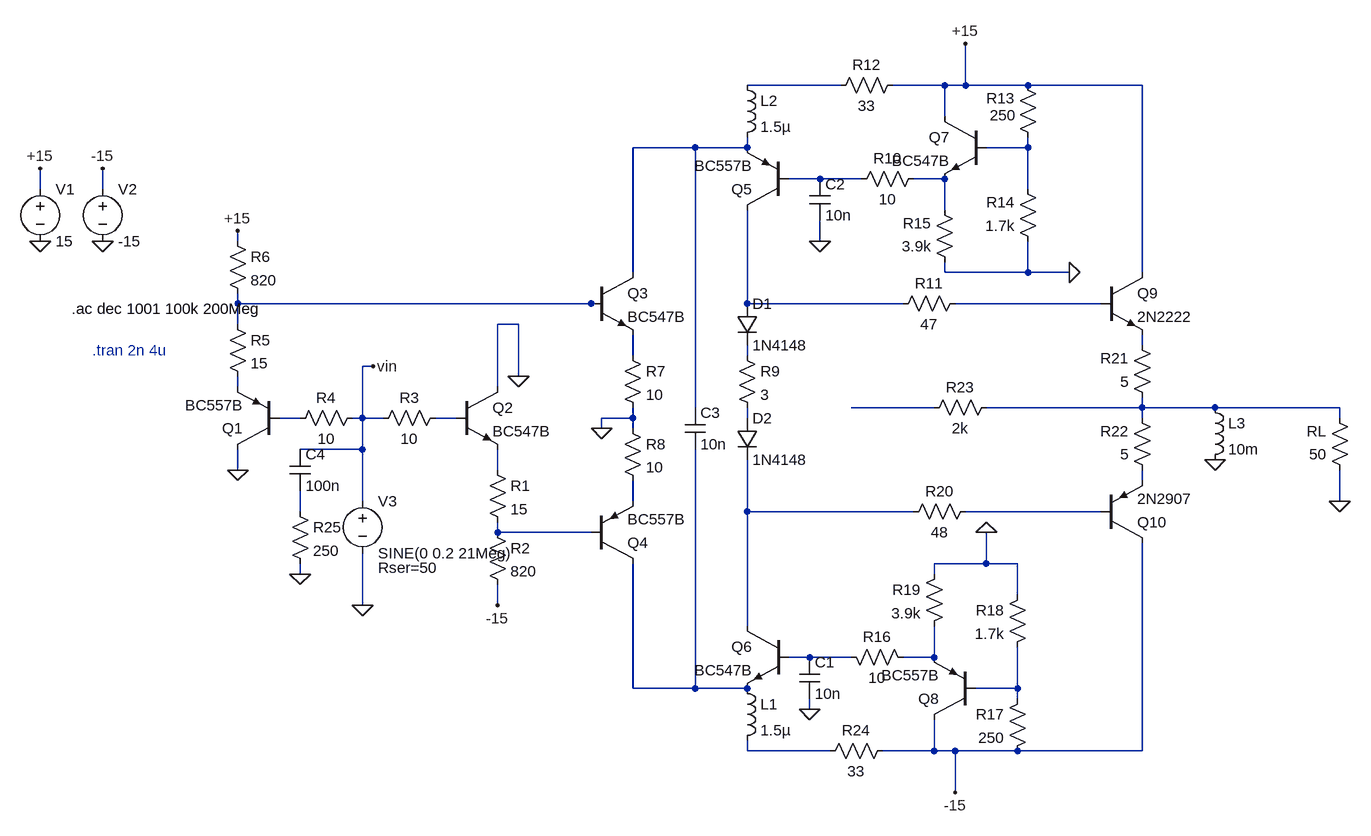
[diagram p0: schematic wideband_amp_lowamp.asc]
wideband_amp_lowamp.asc, the LTspice schematic file:
Version 4
SHEET 1 1428 868
WIRE 640 -304 496 -304
WIRE 800 -304 720 -304
WIRE 832 -304 832 -368
WIRE 832 -304 800 -304
WIRE 928 -304 832 -304
WIRE 1104 -304 928 -304
WIRE 800 -256 800 -304
WIRE 416 -208 320 -208
WIRE 496 -208 496 -224
WIRE 496 -208 416 -208
WIRE 928 -208 928 -224
WIRE 928 -208 864 -208
WIRE 608 -160 560 -160
WIRE 672 -160 608 -160
WIRE 800 -160 752 -160
WIRE -592 -144 -592 -176
WIRE -496 -144 -496 -176
WIRE 928 -144 928 -208
WIRE 800 -112 800 -160
WIRE -288 -64 -288 -80
WIRE 608 -64 608 -96
WIRE 320 -16 320 -208
WIRE 800 -16 800 -32
WIRE 928 -16 928 -64
WIRE 928 -16 800 -16
WIRE 992 -16 928 -16
WIRE 1104 -16 1104 -304
WIRE -288 32 -288 16
WIRE 256 32 -288 32
WIRE 272 32 256 32
WIRE 496 32 496 -112
WIRE 736 32 496 32
WIRE 1040 32 816 32
WIRE -288 64 -288 32
WIRE 144 64 112 64
WIRE 1104 96 1104 80
WIRE 320 112 320 80
WIRE 496 112 496 96
WIRE -80 128 -96 128
WIRE 144 144 144 64
WIRE -288 160 -288 144
WIRE 112 160 112 64
WIRE 416 192 416 -208
WIRE 784 192 656 192
WIRE 1104 192 1104 176
WIRE 1104 192 864 192
WIRE 1216 192 1104 192
WIRE 1408 192 1216 192
WIRE -192 208 -224 208
WIRE -96 208 -96 128
WIRE -96 208 -112 208
WIRE -64 208 -96 208
WIRE 48 208 16 208
WIRE 320 208 320 192
WIRE 320 208 272 208
WIRE 496 208 496 192
WIRE 1104 208 1104 192
WIRE 1408 208 1408 192
WIRE 272 224 272 208
WIRE 320 224 320 208
WIRE -96 256 -96 208
WIRE -96 256 -192 256
WIRE -288 288 -288 256
WIRE 112 288 112 256
WIRE 1104 304 1104 288
WIRE -96 336 -96 256
WIRE 320 336 320 304
WIRE 1408 336 1408 288
WIRE -192 352 -192 320
WIRE 496 352 496 272
WIRE 752 352 496 352
WIRE 1040 352 832 352
WIRE 112 384 112 368
WIRE 256 384 112 384
WIRE 864 432 864 384
WIRE 864 432 784 432
WIRE 912 432 864 432
WIRE -192 448 -192 432
WIRE 784 448 784 432
WIRE 912 480 912 432
WIRE -96 496 -96 416
WIRE 112 496 112 464
WIRE 496 528 496 352
WIRE 592 576 560 576
WIRE 656 576 592 576
WIRE 784 576 784 528
WIRE 784 576 736 576
WIRE 320 624 320 432
WIRE 416 624 416 256
WIRE 416 624 320 624
WIRE 496 624 416 624
WIRE 912 624 912 560
WIRE 912 624 848 624
WIRE 912 640 912 624
WIRE 592 656 592 640
WIRE 496 720 496 704
WIRE 624 720 496 720
WIRE 784 720 784 672
WIRE 784 720 704 720
WIRE 816 720 784 720
WIRE 912 720 816 720
WIRE 1104 720 1104 400
WIRE 1104 720 912 720
WIRE 816 784 816 720
FLAG -592 -64 0
FLAG -496 -64 0
FLAG -592 -176 +15
FLAG -496 -176 -15
FLAG 112 496 -15
FLAG 144 144 0
FLAG -288 288 0
FLAG -288 -80 +15
FLAG 272 224 0
FLAG 592 656 0
FLAG 608 -64 0
FLAG 832 -368 +15
FLAG 992 -16 0
FLAG 816 784 -15
FLAG 864 384 0
FLAG -96 496 0
FLAG 1408 336 0
FLAG -80 128 vin
FLAG -192 448 0
FLAG 1216 272 0
DATAFLAG -96 32 "$"
DATAFLAG 208 384 "$"
DATAFLAG 864 624 "$"
DATAFLAG 656 352 "$"
DATAFLAG 944 32 "$"
DATAFLAG 960 352 "$"
DATAFLAG 672 32 "$"
DATAFLAG 608 576 "$"
DATAFLAG 608 -160 "$"
DATAFLAG 512 720 "$"
DATAFLAG 560 -304 "$"
DATAFLAG 928 -208 "$"
DATAFLAG 1248 192 "$"
DATAFLAG 688 192 "$"
SYMBOL pnp -224 256 R180
SYMATTR InstName Q1
SYMATTR Value BC557B
SYMBOL npn 48 160 R0
SYMATTR InstName Q2
SYMATTR Value BC547B
SYMBOL voltage -592 -160 R0
SYMATTR InstName V1
SYMATTR Value 15
SYMATTR SpiceLine Rser=0
SYMBOL voltage -496 -160 R0
SYMATTR InstName V2
SYMATTR Value -15
SYMBOL res 96 272 R0
SYMATTR InstName R1
SYMATTR Value 15
SYMBOL res 96 368 R0
SYMATTR InstName R2
SYMATTR Value 820
SYMBOL res 32 192 R90
WINDOW 0 0 56 VBottom 2
WINDOW 3 32 56 VTop 2
SYMATTR InstName R3
SYMATTR Value 10
SYMBOL res -96 192 R90
WINDOW 0 0 56 VBottom 2
WINDOW 3 32 56 VTop 2
SYMATTR InstName R4
SYMATTR Value 10
SYMBOL res -304 48 R0
SYMATTR InstName R5
SYMATTR Value 15
SYMBOL res -304 -80 R0
SYMATTR InstName R6
SYMATTR Value 820
SYMBOL npn 256 -16 R0
SYMATTR InstName Q3
SYMATTR Value BC547B
SYMBOL pnp 256 432 M180
SYMATTR InstName Q4
SYMATTR Value BC557B
SYMBOL res 304 96 R0
SYMATTR InstName R7
SYMATTR Value 10
SYMBOL res 304 208 R0
SYMATTR InstName R8
SYMATTR Value 10
SYMBOL pnp 560 -112 R180
SYMATTR InstName Q5
SYMATTR Value BC557B
SYMBOL npn 560 528 M0
SYMATTR InstName Q6
SYMATTR Value BC547B
SYMBOL diode 480 208 R0
SYMATTR InstName D2
SYMATTR Value 1N4148
SYMBOL res 480 96 R0
SYMATTR InstName R9
SYMATTR Value 3
SYMBOL cap 576 576 R0
SYMATTR InstName C1
SYMATTR Value 10n
SYMBOL cap 592 -160 R0
SYMATTR InstName C2
SYMATTR Value 10n
SYMBOL res 768 -176 R90
WINDOW 0 0 56 VBottom 2
WINDOW 3 32 56 VTop 2
SYMATTR InstName R10
SYMATTR Value 10
SYMBOL npn 864 -256 M0
SYMATTR InstName Q7
SYMATTR Value BC547B
SYMBOL res 736 -320 R90
WINDOW 0 0 56 VBottom 2
WINDOW 3 32 56 VTop 2
SYMATTR InstName R12
SYMATTR Value 33
SYMBOL res 944 -208 R180
WINDOW 0 36 76 Left 2
WINDOW 3 34 50 Left 2
SYMATTR InstName R13
SYMATTR Value 250
SYMBOL res 944 -48 R180
WINDOW 0 36 76 Left 2
WINDOW 3 36 40 Left 2
SYMATTR InstName R14
SYMATTR Value 1.7k
SYMBOL res 816 -16 R180
WINDOW 0 36 76 Left 2
WINDOW 3 36 40 Left 2
SYMATTR InstName R15
SYMATTR Value 3.9k
SYMBOL res 752 592 M270
WINDOW 0 32 56 VTop 2
WINDOW 3 0 56 VBottom 2
SYMATTR InstName R16
SYMATTR Value 10
SYMBOL res 928 624 M0
SYMATTR InstName R17
SYMATTR Value 250
SYMBOL res 928 464 M0
SYMATTR InstName R18
SYMATTR Value 1.7k
SYMBOL res 800 432 M0
SYMATTR InstName R19
SYMATTR Value 3.9k
SYMBOL pnp 848 672 R180
SYMATTR InstName Q8
SYMATTR Value BC557B
SYMBOL voltage -96 320 R0
WINDOW 39 24 118 Left 2
SYMATTR SpiceLine Rser=50
SYMATTR InstName V3
SYMATTR Value SINE(0 0.2 21Meg)
SYMATTR Value2 AC 1
SYMBOL npn 1040 -16 R0
SYMATTR InstName Q9
SYMATTR Value 2N2222
SYMBOL pnp 1040 400 M180
SYMATTR InstName Q10
SYMATTR Value 2N2907
SYMBOL res 832 16 R90
WINDOW 0 0 56 VBottom 2
WINDOW 3 32 56 VTop 2
SYMATTR InstName R11
SYMATTR Value 47
SYMBOL res 848 336 R90
WINDOW 0 0 56 VBottom 2
WINDOW 3 32 56 VTop 2
SYMATTR InstName R20
SYMATTR Value 48
SYMBOL res 1120 192 R180
WINDOW 0 36 76 Left 2
WINDOW 3 36 40 Left 2
SYMATTR InstName R21
SYMATTR Value 5
SYMBOL res 1120 304 R180
WINDOW 0 36 76 Left 2
WINDOW 3 36 40 Left 2
SYMATTR InstName R22
SYMATTR Value 5
SYMBOL res 1424 304 R180
WINDOW 0 36 76 Left 2
WINDOW 3 36 40 Left 2
SYMATTR InstName RL
SYMATTR Value 50
SYMBOL cap 400 192 R0
SYMATTR InstName C3
SYMATTR Value 10n
SYMBOL res 880 176 R90
WINDOW 0 0 56 VBottom 2
WINDOW 3 32 56 VTop 2
SYMATTR InstName R23
SYMATTR Value 2k
SYMBOL diode 480 32 R0
SYMATTR InstName D1
SYMATTR Value 1N4148
SYMBOL res 720 704 R90
WINDOW 0 0 56 VBottom 2
WINDOW 3 32 56 VTop 2
SYMATTR InstName R24
SYMATTR Value 33
SYMBOL cap -208 256 R0
SYMATTR InstName C4
SYMATTR Value 100n
SYMBOL res -208 336 R0
SYMATTR InstName R25
SYMATTR Value 250
SYMBOL ind 480 608 R0
SYMATTR InstName L1
SYMATTR Value 1.5µ
SYMATTR SpiceLine Rser=4
SYMBOL ind 480 -320 R0
SYMATTR InstName L2
SYMATTR Value 1.5µ
SYMATTR SpiceLine Rser=4
SYMBOL ind 1200 176 R0
SYMATTR InstName L3
SYMATTR Value 10m
TEXT -544 40 Left 2 !.ac dec 1001 100k 200Meg
TEXT -512 104 Left 2 ;.tran 2n 4u

The netlist it stands for:
* wideband_amp_lowamp.asc
Q1 0 N015 N012 0 BC557B
Q2 0 N016 N018 0 BC547B
V1 +15 0 15 Rser=0
V2 -15 0 -15
R1 N018 N024 15
R2 N024 -15 820
R3 N016 vin 10
R4 vin N015 10
R5 N006 N012 15
R6 +15 N006 820
Q3 N002 N006 N010 0 BC547B
Q4 N027 N024 N020 0 BC557B
R7 N010 0 10
R8 0 N020 10
Q5 N007 N004 N002 0 BC557B
Q6 N022 N025 N027 0 BC547B
D2 N017 N022 1N4148
R9 N011 N017 3
C1 N025 0 10n
C2 N004 0 10n
R10 N005 N004 10
Q7 +15 N003 N005 0 BC547B
R12 +15 N001 33
R13 N003 +15 250
R14 0 N003 1.7k
R15 0 N005 3.9k
R16 N026 N025 10
R17 N028 -15 250
R18 0 N028 1.7k
R19 0 N026 3.9k
Q8 -15 N028 N026 0 BC557B
V3 vin 0 SINE(0 0.2 21Meg) AC 1 Rser=50
Q9 +15 N008 N009 0 2N2222
Q10 -15 N023 N019 0 2N2907
R11 N008 N007 47
R20 N023 N022 48
R21 N014 N009 5
R22 N019 N014 5
RL 0 N014 50
C3 N002 N027 10n
R23 N014 N013 2k
D1 N007 N011 1N4148
R24 -15 N029 33
C4 vin N021 100n
R25 N021 0 250
L1 N027 N029 1.5µ Rser=4
L2 N001 N002 1.5µ Rser=4
L3 N014 0 10m
.model D D
.lib standard.dio
.model NPN NPN
.model PNP PNP
.lib standard.bjt
.ac dec 1001 100k 200Meg
* .tran 2n 4u
.backanno
.end